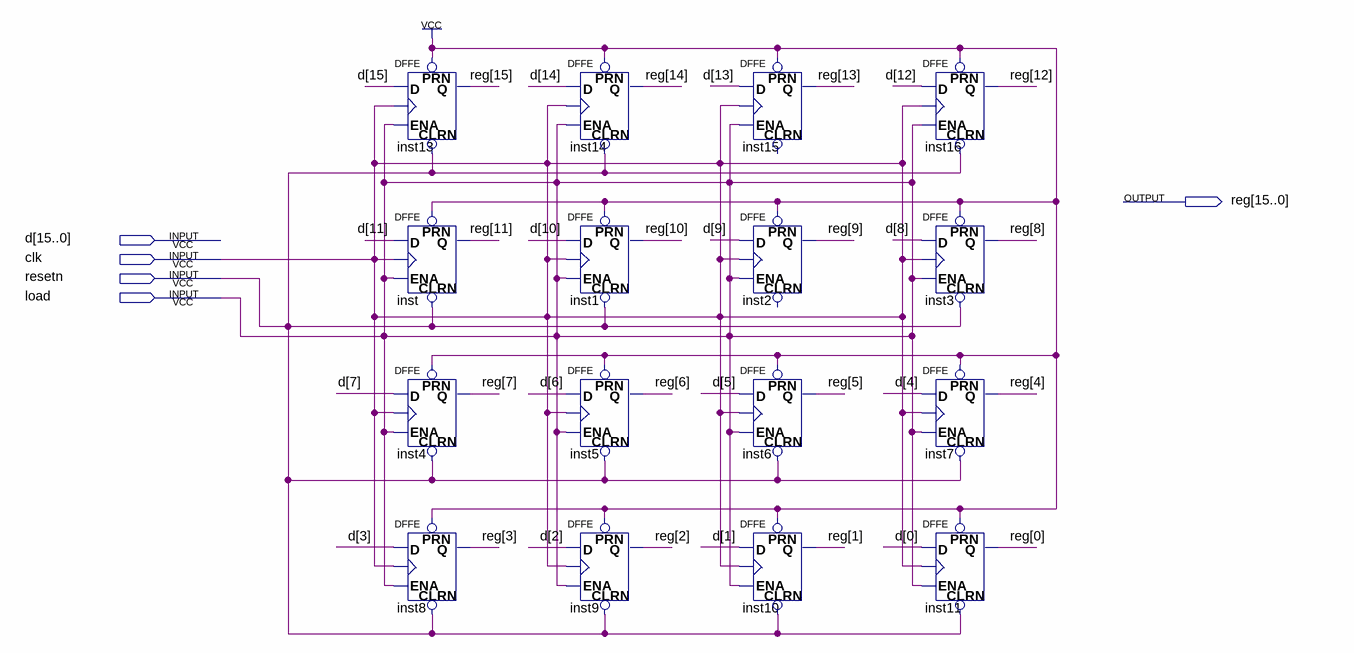
[diagram p0: schematic sheet]
// Quartus schematic reg16.bdf as structural Verilog: 16 symbols, 5 pins
module reg16 (
  input  [15:0] d,
  input  clk,
  input  resetn,
  input  load,
  output [15:0] \reg 
);

  DFFE inst13 (.PRN(1'b1), .CLRN(resetn), .D(d[15]), .CLK(clk), .ENA(load), .Q(\reg [15]));
  DFFE inst (.PRN(1'b1), .CLRN(resetn), .D(d[11]), .CLK(clk), .ENA(load), .Q(\reg [11]));
  DFFE inst4 (.PRN(1'b1), .CLRN(resetn), .D(d[7]), .CLK(clk), .ENA(load), .Q(\reg [7]));
  DFFE inst8 (.PRN(1'b1), .CLRN(resetn), .D(d[3]), .CLK(clk), .ENA(load), .Q(\reg [3]));
  DFFE inst14 (.PRN(1'b1), .CLRN(resetn), .D(d[14]), .CLK(clk), .ENA(load), .Q(\reg [14]));
  DFFE inst1 (.PRN(1'b1), .CLRN(resetn), .D(d[10]), .CLK(clk), .ENA(load), .Q(\reg [10]));
  DFFE inst5 (.PRN(1'b1), .CLRN(resetn), .D(d[6]), .CLK(clk), .ENA(load), .Q(\reg [6]));
  DFFE inst9 (.PRN(1'b1), .CLRN(resetn), .D(d[2]), .CLK(clk), .ENA(load), .Q(\reg [2]));
  DFFE inst15 (.PRN(1'b1), .D(d[13]), .CLK(clk), .ENA(load), .Q(\reg [13]));  // open: CLRN
  DFFE inst2 (.PRN(1'b1), .D(d[9]), .CLK(clk), .ENA(load), .Q(\reg [9]));  // open: CLRN
  DFFE inst6 (.PRN(1'b1), .CLRN(resetn), .D(d[5]), .CLK(clk), .ENA(load), .Q(\reg [5]));
  DFFE inst10 (.PRN(1'b1), .CLRN(resetn), .D(d[1]), .CLK(clk), .ENA(load), .Q(\reg [1]));
  DFFE inst16 (.PRN(1'b1), .CLRN(resetn), .D(d[12]), .CLK(clk), .ENA(load), .Q(\reg [12]));
  DFFE inst3 (.PRN(1'b1), .CLRN(resetn), .D(d[8]), .CLK(clk), .ENA(load), .Q(\reg [8]));
  DFFE inst7 (.PRN(1'b1), .CLRN(resetn), .D(d[4]), .CLK(clk), .ENA(load), .Q(\reg [4]));
  DFFE inst11 (.PRN(1'b1), .CLRN(resetn), .D(d[0]), .CLK(clk), .ENA(load), .Q(\reg [0]));
endmodule
